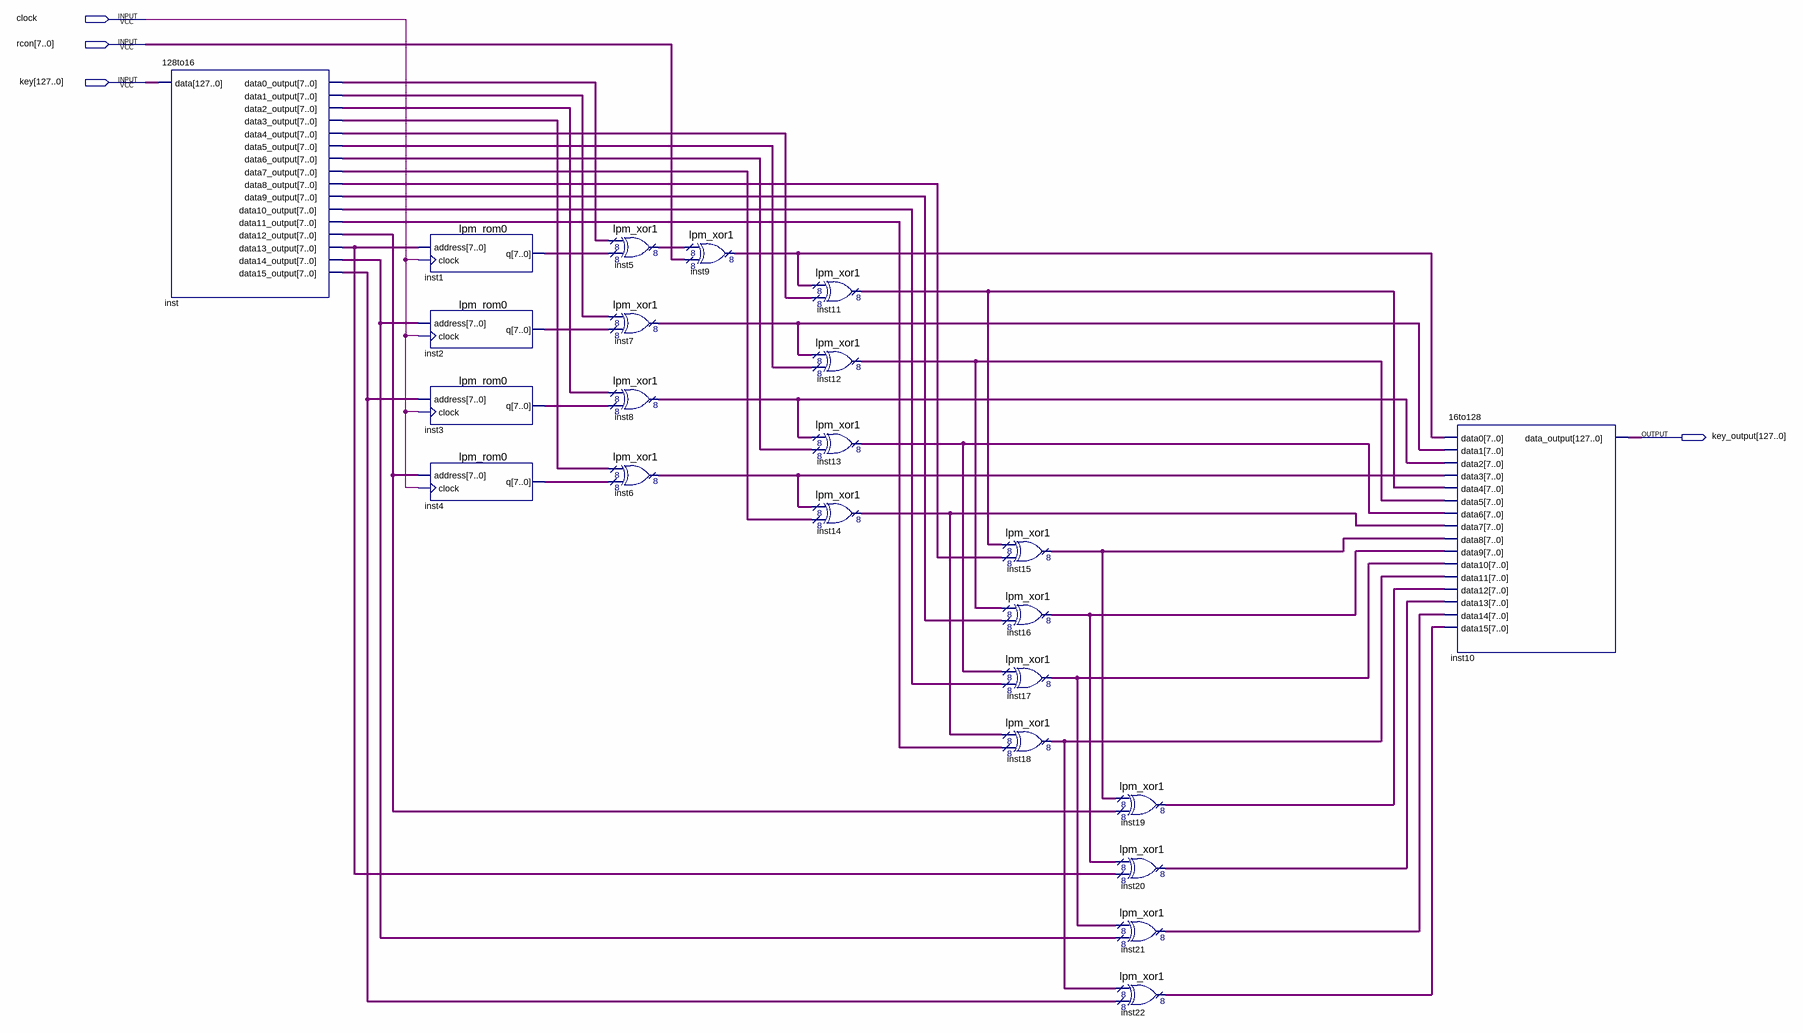
[diagram p0: schematic sheet]
// Quartus schematic key_expansion.bdf as structural Verilog: 23 symbols, 4 pins
module key_expansion (
  input  clock,
  input  [7:0] rcon,
  input  [127:0] key,
  output [127:0] key_output
);

  wire [7:0] inst1_q, inst2_q, inst3_q, inst4_q, inst5_result, inst6_result, inst7_result, inst8_result,
       inst9_result, inst11_result, inst12_result, inst13_result, inst14_result, inst15_result,
       inst16_result, inst17_result, inst18_result, inst19_result, inst20_result, inst21_result,
       inst22_result, inst_data0_output, inst_data1_output, inst_data2_output, inst_data3_output,
       inst_data4_output, inst_data5_output, inst_data6_output, inst_data7_output, inst_data8_output,
       inst_data9_output, inst_data10_output, inst_data11_output, inst_data12_output, inst_data13_output,
       inst_data14_output, inst_data15_output;

  \128to16  inst (
    .data(key), .data0_output(inst_data0_output), .data1_output(inst_data1_output),
    .data2_output(inst_data2_output), .data3_output(inst_data3_output), .data4_output(inst_data4_output),
    .data5_output(inst_data5_output), .data6_output(inst_data6_output), .data7_output(inst_data7_output),
    .data8_output(inst_data8_output), .data9_output(inst_data9_output), .data10_output(inst_data10_output),
    .data11_output(inst_data11_output), .data12_output(inst_data12_output),
    .data13_output(inst_data13_output), .data14_output(inst_data14_output), .data15_output(inst_data15_output));
  lpm_rom0 inst1 (.address(inst_data13_output), .clock(clock), .q(inst1_q));
  lpm_rom0 inst2 (.address(inst_data14_output), .clock(clock), .q(inst2_q));
  lpm_rom0 inst3 (.address(inst_data15_output), .clock(clock), .q(inst3_q));
  lpm_rom0 inst4 (.address(inst_data12_output), .clock(clock), .q(inst4_q));
  lpm_xor1 inst5 (.data0x(inst_data0_output), .data1x(inst1_q), .result(inst5_result));
  lpm_xor1 inst7 (.data0x(inst_data1_output), .data1x(inst2_q), .result(inst7_result));
  lpm_xor1 inst8 (.data0x(inst_data2_output), .data1x(inst3_q), .result(inst8_result));
  lpm_xor1 inst6 (.data0x(inst_data3_output), .data1x(inst4_q), .result(inst6_result));
  lpm_xor1 inst9 (.data0x(inst5_result), .data1x(rcon), .result(inst9_result));
  lpm_xor1 inst11 (.data0x(inst9_result), .data1x(inst_data4_output), .result(inst11_result));
  lpm_xor1 inst12 (.data0x(inst7_result), .data1x(inst_data5_output), .result(inst12_result));
  lpm_xor1 inst13 (.data0x(inst8_result), .data1x(inst_data6_output), .result(inst13_result));
  lpm_xor1 inst14 (.data0x(inst6_result), .data1x(inst_data7_output), .result(inst14_result));
  lpm_xor1 inst15 (.data0x(inst11_result), .data1x(inst_data8_output), .result(inst15_result));
  lpm_xor1 inst16 (.data0x(inst12_result), .data1x(inst_data9_output), .result(inst16_result));
  lpm_xor1 inst17 (.data0x(inst13_result), .data1x(inst_data10_output), .result(inst17_result));
  lpm_xor1 inst18 (.data0x(inst14_result), .data1x(inst_data11_output), .result(inst18_result));
  lpm_xor1 inst19 (.data0x(inst15_result), .data1x(inst_data12_output), .result(inst19_result));
  lpm_xor1 inst20 (.data0x(inst16_result), .data1x(inst_data13_output), .result(inst20_result));
  lpm_xor1 inst21 (.data0x(inst17_result), .data1x(inst_data14_output), .result(inst21_result));
  lpm_xor1 inst22 (.data0x(inst18_result), .data1x(inst_data15_output), .result(inst22_result));
  \16to128  inst10 (
    .data0(inst9_result), .data1(inst7_result), .data2(inst8_result), .data3(inst6_result),
    .data4(inst11_result), .data5(inst12_result), .data6(inst13_result), .data7(inst14_result),
    .data8(inst15_result), .data9(inst16_result), .data10(inst17_result), .data11(inst18_result),
    .data12(inst19_result), .data13(inst20_result), .data14(inst21_result), .data15(inst22_result),
    .data_output(key_output));
endmodule
